# EAGLE design SOT23-6-minimal (EAGLE 6.5.0)
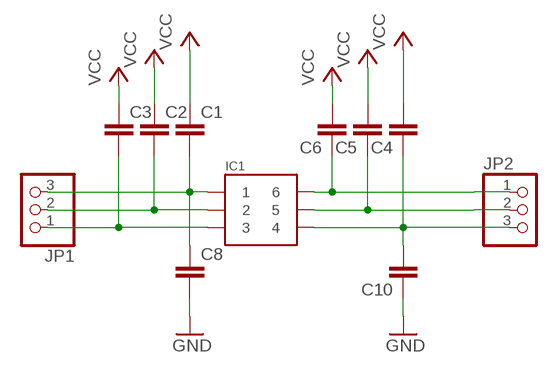
[diagram p0: schematic, sheet 1]

## Parts
C1  C-EUC0603  [C0603]
C2  C-EUC0603  [C0603]
C3  C-EUC0603  [C0603]
C4  C-EUC0603  [C0603]
C5  C-EUC0603  [C0603]
C6  C-EUC0603  [C0603]
C8  C-EUC0603  [C0603]
C10  C-EUC0603  [C0603]
IC1  2X3-PIN-SOT23  [SOT23-6]
JP1  PINHD-1X3  [1X03]
JP2  PINHD-1X3  [1X03]

## Nets
1: C1.2 C8.1 IC1.P$1 JP1.3
2: C2.2 IC1.P$2 JP1.2
3: C3.2 IC1.P$3 JP1.1
4: C4.1 C10.2 IC1.P$4 JP2.3
5: C5.1 IC1.P$5 JP2.2
6: C6.1 IC1.P$6 JP2.1
GND: C8.2 C10.1
VCC: C1.1 C2.1 C3.1 C4.2 C5.2 C6.2

## Library data of the parts
C1-C6 C8 C10 = p.peter-rcl:C-EU: CAPACITOR, European symbol
IC1 = p.peter-pacakages:2X3-PIN
JP1 JP2 = pinhead:PINHD-1X3: PIN HEADER

## Board
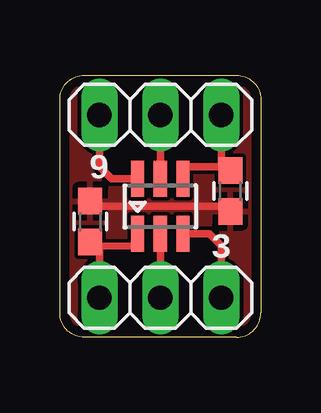
[diagram p1: board, top side]
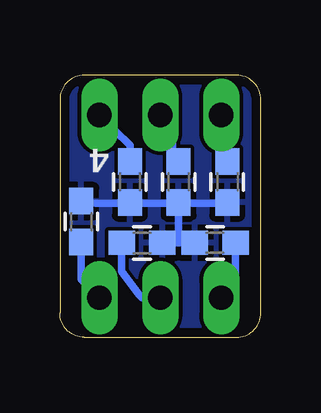
[diagram p2: board, bottom side, seen from below]

Size 8.38 x 10.92 mm. Coordinates in mm from the lower left corner, seen from the top.
Outline: 1.02,10.92 1.14,10.92
Outline: 1.14,10.92 7.37,10.92 arc-90 8.38,9.91 8.38,1.02 arc-90 7.37,0 1.02,0 arc-90 0,1.02 0,9.91 arc-90 1.02,10.92
Outline: 1.02,10.92 1.14,10.92
Copper layers (1*16): Top 0.0356mm / dielectric 1.5011mm / Bottom 0.0356mm
Design rules "oshpark": minimum track width 6mil, minimum drill 13mil, track to track 6mil, track to pad 6mil, pad to pad 6mil, via to via 6mil, smd to smd 6mil, copper to edge 15mil, drill to drill 6mil, minimum pad ring 7mil, minimum via ring 7mil, stop-mask expansion 4mil, vias tented up to drill 4.1mm, thermal gap 10mil

### Footprints (pad centres in the part's own frame; a part is rotated, then mirrored left to right if it is on the bottom)
C0603 = smd 1.1 x 1: 1 -0.85,0; 2 0.85,0
SOT23-6 = smd 0.55 x 1.5: P$1 -0.95,-1.15; P$2 0,-1.15; P$3 0.95,-1.15; P$4 0.95,1.15; P$5 0,1.15; P$6 -0.95,1.15
1X03 = drill 1.016 long: 1 -2.54,0; 2 0,0; 3 2.54,0

### Placement (x,y rotation side)
C1  1.91,3.94 0 bottom
C2  4.95,3.94 180 bottom
C3  7.49,4.83 270 bottom
C4  5.46,6.48 270 bottom
C5  3.43,6.48 270 bottom
C6  1.4,6.48 270 bottom
C8  1.27,4.83 90 top
C10  7.11,6.1 90 top
IC1  4.19,5.46 0 top
JP1  4.19,1.65 180 top
JP2  4.19,9.27 0 top

### Tracks (layer width: path | path; a pad name or v marks a point on that pad's centre or on a via)
1
  Top 0.305: IC1.P$1 arc90 3.17,4.25 3.17,3.81 1.28,3.8 | 1.28,3.8 1.27,4.32 C8.1 1.27,3.94 1.28,3.8 | 1.28,3.8 1.52,3.81 1.65,3.81 JP1.3
  Bottom 0.305: C1.2 1.05,1.99 1.4,1.65 JP1.3
2
  Top 0.305: IC1.P$2 JP1.2
  Bottom 0.305: C2.2 5.8,2.75 5.08,1.78 4.95,1.65 JP1.2
3
  Top 0.305: IC1.P$3 6.23,4.31 6.73,3.81 JP1.1
  Bottom 0.305: C3.2 7.49,2.41 JP1.1
4
  Top 0.305: IC1.P$4 5.14,7.05 5.21,7.11 | 5.21,7.11 6.73,7.11 | 6.73,7.11 6.86,7.11 | 6.86,7.11 6.95,7.11 C10.2 | 5.21,7.11 6.73,7.11 | 6.73,7.11 6.86,7.11 | 6.86,7.11 6.73,7.11 | 6.73,7.11 JP2.3
  Bottom 0.305: C4.1 5.46,8 6.1,8.64 JP2.3
5
  Top 0.305: IC1.P$5 JP2.2
  Bottom 0.305: C5.1 3.68,7.37 3.68,8.51 JP2.2
6
  Top 0.305: IC1.P$6 3.18,6.61 3.17,6.6 2.16,6.6 1.65,7.11 JP2.1
  Bottom 0.305: C6.1 1.61,7.33 1.65,7.49 1.65,8.13 1.65,8.64 JP2.1
GND
  Top 0.305: C8.2 1.27,5.59 1.4,5.46 6.9,5.46 C10.1
  pour Top: -0.25,-0.25 -0.25,11.18 8.64,11.18 8.64,-0.25
VCC
  Bottom 0.305: C1.1 3.43,3.94 | 3.43,3.94 C2.1 | C6.2 1.14,5.59 2.88,5.59 C5.2 3.01,5.63 3.05,5.59 | 3.05,5.59 3.43,5.59 | 3.43,5.59 4.91,5.59 C4.2 4.95,5.59 6.9,5.59 C3.1 | 3.05,5.59 3.43,5.59 | 3.43,5.59 3.43,3.94
  pour Bottom: -0.25,-0.25 -0.25,11.18 8.64,11.18 8.64,-0.25

### Text on the board
tPlace: 6 | 3
bPlace: 4